# EAGLE board BLL-EBOOK-3506 (EAGLE 9.6.2)
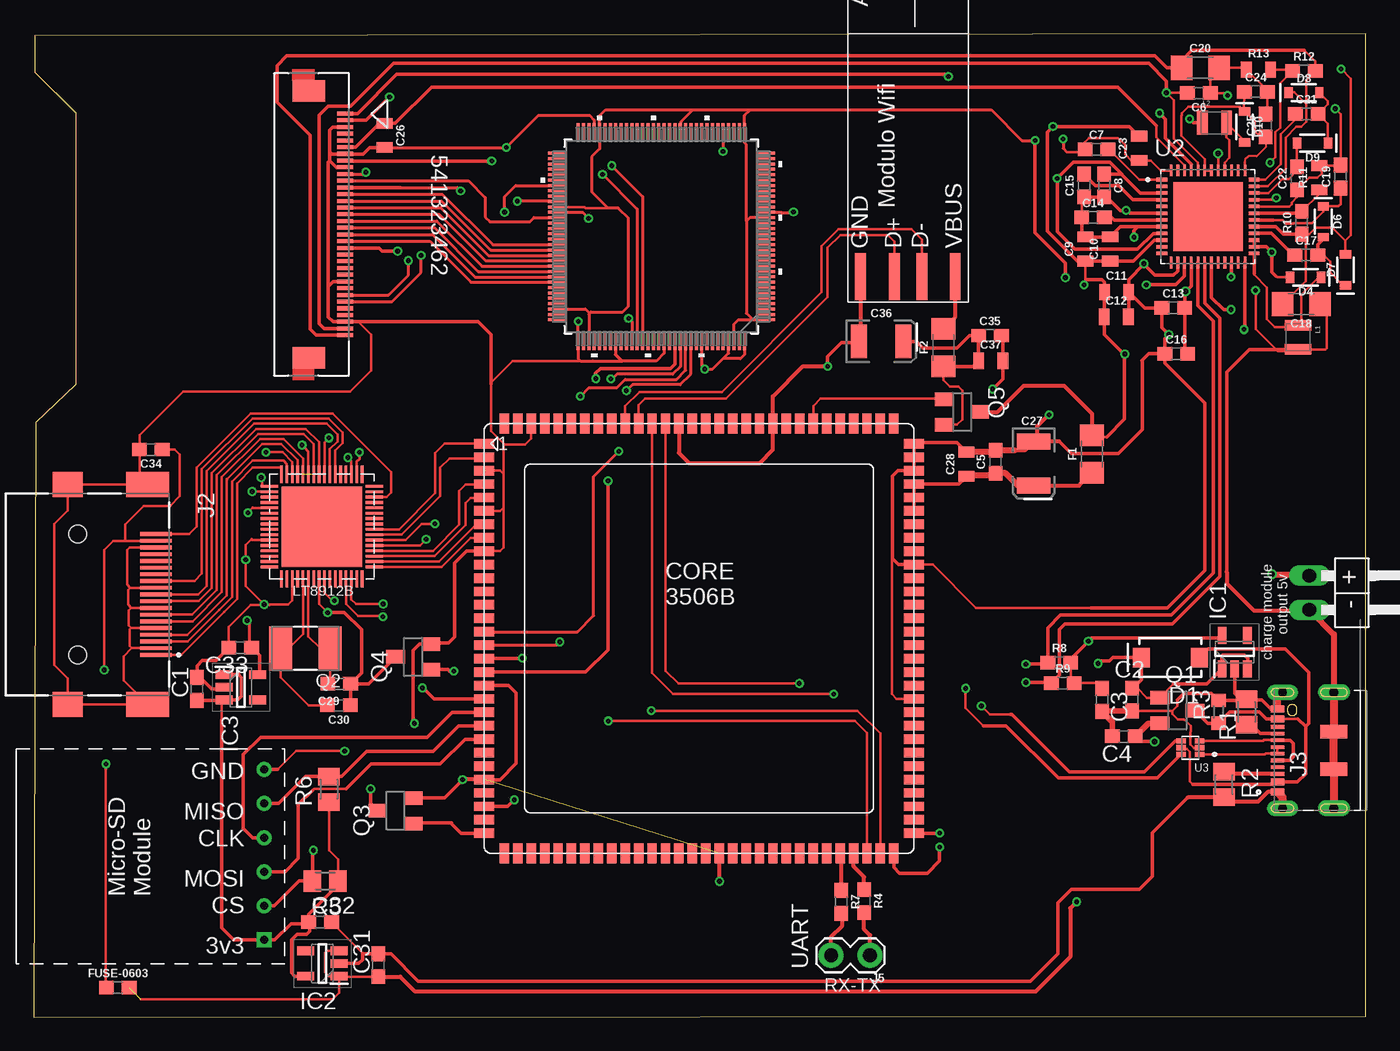
[diagram p2: board, top side]
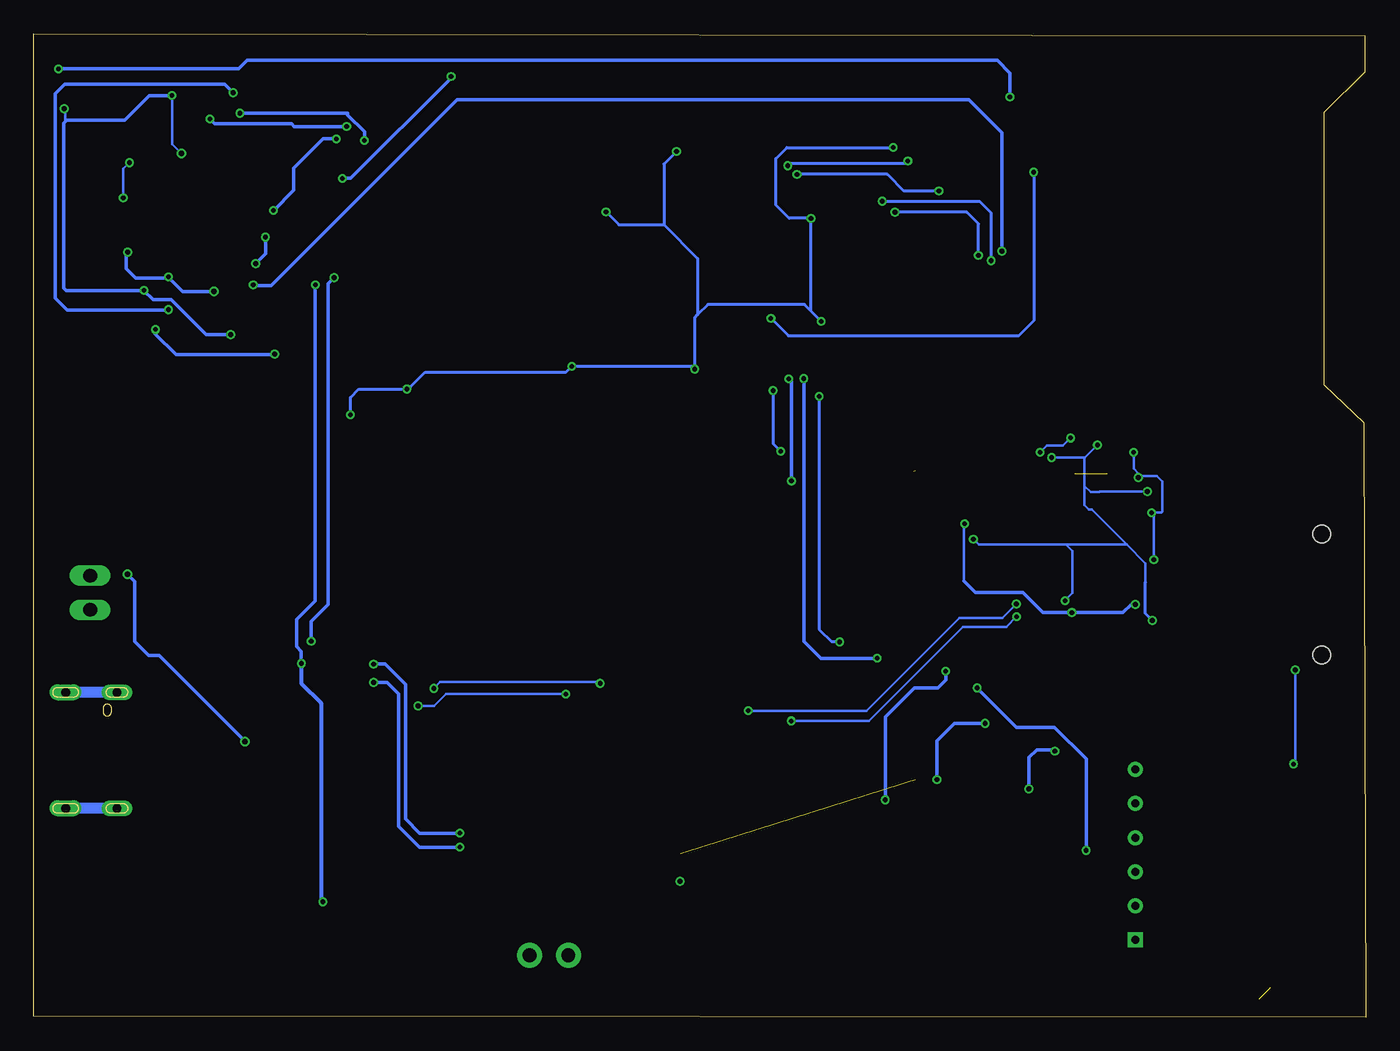
[diagram p3: board, bottom side, seen from below]

Size 99.21 x 73.24 mm. Coordinates in mm from the lower left corner, seen from the top.
Outline: 0,0 99.19,0.05 99.21,73.24 0.1,73.09 0.1,70.36 3.12,67.34 3.12,47.12 0.15,44.27 0,0
Copper layers (1*16): Top 0.035mm / dielectric 1.5mm / Bottom 0.035mm
Design rules "default *": minimum track width 6.5mil, minimum drill 0.15mm, track to track 6.5mil, track to pad 0.1mm, pad to pad 0.15mm, via to via 6mil, smd to smd 0.15mm, copper to edge 40mil, drill to drill 0.2mm, minimum pad ring 10mil, minimum via ring 0.15mm, stop-mask expansion 4mil, vias tented up to drill 0mil, thermal gap 10mil

## Footprints (pad centres in the part's own frame; a part is rotated, then mirrored left to right if it is on the bottom)
C0603 = smd 1.1 x 1: 1 -0.85,0; 2 0.85,0
0603 = smd 1.1 x 1: 1 -0.85,0; 2 0.85,0
0805 = smd 0.8 x 1.2: 1 -0.9,0; 2 0.9,0
1206 = smd 1.6 x 1.8: 1 -1.4,0; 2 1.4,0
EIA3528 = smd 1.2 x 2.5: A 1.65,0; C -1.65,0
SMA-DIODE = smd 1.27 x 1.47: A -2.15,0; C 2.15,0
SOD-323 = smd 0.63 x 0.83: A 1.15,0; C -1.15,0
SOT94P280X100-5N = smd 1.25 x 0.65: 1 -1.25,0.94; 2 -1.25,0; 3 -1.25,-0.94; 4 1.25,-0.94; 5 1.25,0.94
CON_541323462_MOL = smd 0.3 x 1.2: 1 -8.25,2.498; 2 -7.75,2.498; 3 -7.25,2.498; 4 -6.75,2.498; 5 -6.25,2.498; 6 -5.75,2.498; 7 -5.25,2.498; 8 -4.75,2.498; 9 -4.25,2.498; 10 -3.75,2.498; 11 -3.25,2.498; 12 -2.75,2.498; 13 -2.25,2.498; 14 -1.75,2.498; 15 -1.25,2.498; 16 -0.75,2.498; 17 -0.25,2.498; 18 0.25,2.498; 19 0.75,2.498; 20 1.25,2.498; 21 1.75,2.498; 22 2.25,2.498; 23 2.75,2.498; 24 3.25,2.498; 25 3.75,2.498; 26 4.25,2.498; 27 4.75,2.498; 28 5.25,2.498; 29 5.75,2.498; 30 6.25,2.498; 31 6.75,2.498; 32 7.25,2.498; 33 7.75,2.498; 34 8.25,2.498 | smd 1.6 x 2.4: P1 -9.95,-0.202; P2 9.95,-0.202
SAMTEC_HDMR-19-02-F-SM = smd 0.28 x 2.35: 01 4.5,5.825; 02 4,5.825; 03 3.5,5.825; 04 3,5.825; 05 2.5,5.825; 06 2,5.825; 07 1.5,5.825; 08 1,5.825; 09 0.5,5.825; 10 0,5.825; 11 -0.5,5.825; 12 -1,5.825; 13 -1.5,5.825; 14 -2,5.825; 15 -2.5,5.825; 16 -3,5.825; 17 -3.5,5.825; 18 -4,5.825; 19 -4.5,5.825 | smd 1.85 x 2.24: S1 -8.18,-0.76; S2 8.18,-0.76 | smd 1.85 x 3.2: S3 -8.18,5.2; S4 8.18,5.2 | hole 1.32: 4.5,0; -4.5,0
JAE_DX07S016JA1R1500 = smd 0.52 x 1: 1 -3.1,1.1; 2 -2.35,1.1; 11 2.35,1.1; 12 3.1,1.1 | smd 0.27 x 1: 3 -1.75,1.1; 4 -1.25,1.1; 5 -0.75,1.1; 6 -0.25,1.1; 7 0.25,1.1; 8 0.75,1.1; 9 1.25,1.1; 10 1.75,1.1 | smd 1 x 2: S1 -1.4,-3.1; S2 1.4,-3.1 | drill 0.65 long: S3 -4.32,0.725; S4 4.32,0.725 | drill 0.65 pad 1.2 long: S5 -4.32,-3.1; S6 4.32,-3.1
1X02/90 = drill 1.016 long: 1 -1.27,-3.81; 2 1.27,-3.81
1X02_LOCK = drill 1.016 pad 1.88: 1 -0.178,0; 2 2.718,0
1008(2520) = smd 0.8 x 2: 1 -0.9,0; 2 0.9,0
0806 = smd 0.8 x 1.8: 1 -0.9,0; 2 0.9,0
LT8912B = smd 5.969 x 5.969: 65 0,0 | smd 1.3 x 0.2: P0 -3.9,3; P1 -3.9,2.6; P2 -3.9,2.2; P3 -3.9,1.8; P4 -3.9,1.4; P5 -3.9,1; P6 -3.9,0.6; P7 -3.9,0.2; P8 -3.9,-0.2; P9 -3.9,-0.6; P10 -3.9,-1; P11 -3.9,-1.4; P12 -3.9,-1.8; P13 -3.9,-2.2; P14 -3.9,-2.6; P15 -3.9,-3; P16 3.9,-3; P17 3.9,-2.6; P18 3.9,-2.2; P19 3.9,-1.8; P20 3.9,-1.4; P21 3.9,-1; P22 3.9,-0.6; P23 3.9,-0.2; P24 3.9,0.2; P25 3.9,0.6; P26 3.9,1; P27 3.9,1.4; P28 3.9,1.8; P29 3.9,2.2; P30 3.9,2.6; P31 3.9,3 | smd 0.2 x 1.3: P32 -3,-3.9; P33 -2.6,-3.9; P34 -2.2,-3.9; P35 -1.8,-3.9; P36 -1.4,-3.9; P37 -1,-3.9; P38 -0.6,-3.9; P39 -0.2,-3.9; P40 0.2,-3.9; P41 0.6,-3.9; P42 1,-3.9; P43 1.4,-3.9; P44 1.8,-3.9; P45 2.2,-3.9; P46 2.6,-3.9; P47 3,-3.9; P48 3,3.9; P49 2.6,3.9; P50 2.2,3.9; P51 1.8,3.9; P52 1.4,3.9; P53 1,3.9; P54 0.6,3.9; P55 0.2,3.9; P56 -0.2,3.9; P57 -0.6,3.9; P58 -1,3.9; P59 -1.4,3.9; P60 -1.8,3.9; P61 -2.2,3.9; P62 -2.6,3.9; P63 -3,3.9
SOT23 = smd 1 x 1.4: 1 -0.95,-1.306; 2 0.95,-1.306; 3 0,1.306
5.0X3.2_2 = smd 1.7 x 3.3: 1 -1.85,0; 2 1.85,0
M0805 = smd 1.3 x 1.6: 1 -0.95,0; 2 0.95,0
R0603 = smd 1 x 1.1: 1 -0.85,0; 2 0.85,0
QFN50P700X700X100-49N = smd 0.86 x 0.26: 1 -3.435,2.75; 2 -3.435,2.25; 3 -3.435,1.75; 4 -3.435,1.25; 5 -3.435,0.75; 6 -3.435,0.25; 7 -3.435,-0.25; 8 -3.435,-0.75; 9 -3.435,-1.25; 10 -3.435,-1.75; 11 -3.435,-2.25; 12 -3.435,-2.75; 25 3.435,-2.75; 26 3.435,-2.25; 27 3.435,-1.75; 28 3.435,-1.25; 29 3.435,-0.75; 30 3.435,-0.25; 31 3.435,0.25; 32 3.435,0.75; 33 3.435,1.25; 34 3.435,1.75; 35 3.435,2.25; 36 3.435,2.75 | smd 0.26 x 0.86: 13 -2.75,-3.435; 14 -2.25,-3.435; 15 -1.75,-3.435; 16 -1.25,-3.435; 17 -0.75,-3.435; 18 -0.25,-3.435; 19 0.25,-3.435; 20 0.75,-3.435; 21 1.25,-3.435; 22 1.75,-3.435; 23 2.25,-3.435; 24 2.75,-3.435; 37 2.75,3.435; 38 2.25,3.435; 39 1.75,3.435; 40 1.25,3.435; 41 0.75,3.435; 42 0.25,3.435; 43 -0.25,3.435; 44 -0.75,3.435; 45 -1.25,3.435; 46 -1.75,3.435; 47 -2.25,3.435; 48 -2.75,3.435 | smd 5.15 x 5.15: 49 0,0
SOT50P160X60-6N = smd 0.75 x 0.35: 1 -0.69,0.5; 2 -0.69,0; 3 -0.69,-0.5; 4 0.69,-0.5; 5 0.69,0; 6 0.69,0.5
LQFP128_STM = smd 1.353 x 0.229: 1 -7.776,6.2; 2 -7.776,5.8; 3 -7.776,5.4; 4 -7.776,5; 5 -7.776,4.6; 6 -7.776,4.2; 7 -7.776,3.8; 8 -7.776,3.4; 9 -7.776,3; 10 -7.776,2.6; 11 -7.776,2.2; 12 -7.776,1.8; 13 -7.776,1.4; 14 -7.776,1; 15 -7.776,0.6; 16 -7.776,0.2; 17 -7.776,-0.2; 18 -7.776,-0.6; 19 -7.776,-1; 20 -7.776,-1.4; 21 -7.776,-1.8; 22 -7.776,-2.2; 23 -7.776,-2.6; 24 -7.776,-3; 25 -7.776,-3.4; 26 -7.776,-3.8; 27 -7.776,-4.2; 28 -7.776,-4.6; 29 -7.776,-5; 30 -7.776,-5.4; 31 -7.776,-5.8; 32 -7.776,-6.2; 65 7.776,-6.2; 66 7.776,-5.8; 67 7.776,-5.4; 68 7.776,-5; 69 7.776,-4.6; 70 7.776,-4.2; 71 7.776,-3.8; 72 7.776,-3.4; 73 7.776,-3; 74 7.776,-2.6; 75 7.776,-2.2; 76 7.776,-1.8; 77 7.776,-1.4; 78 7.776,-1; 79 7.776,-0.6; 80 7.776,-0.2; 81 7.776,0.2; 82 7.776,0.6; 83 7.776,1; 84 7.776,1.4; 85 7.776,1.8; 86 7.776,2.2; 87 7.776,2.6; 88 7.776,3; 89 7.776,3.4; 90 7.776,3.8; 91 7.776,4.2; 92 7.776,4.6; 93 7.776,5; 94 7.776,5.4; 95 7.776,5.8; 96 7.776,6.2 | smd 0.229 x 1.353: 33 -6.2,-7.776; 34 -5.8,-7.776; 35 -5.4,-7.776; 36 -5,-7.776; 37 -4.6,-7.776; 38 -4.2,-7.776; 39 -3.8,-7.776; 40 -3.4,-7.776; 41 -3,-7.776; 42 -2.6,-7.776; 43 -2.2,-7.776; 44 -1.8,-7.776; 45 -1.4,-7.776; 46 -1,-7.776; 47 -0.6,-7.776; 48 -0.2,-7.776; 49 0.2,-7.776; 50 0.6,-7.776; 51 1,-7.776; 52 1.4,-7.776; 53 1.8,-7.776; 54 2.2,-7.776; 55 2.6,-7.776; 56 3,-7.776; 57 3.4,-7.776; 58 3.8,-7.776; 59 4.2,-7.776; 60 4.6,-7.776; 61 5,-7.776; 62 5.4,-7.776; 63 5.8,-7.776; 64 6.2,-7.776; 97 6.2,7.776; 98 5.8,7.776; 99 5.4,7.776; 100 5,7.776; 101 4.6,7.776; 102 4.2,7.776; 103 3.8,7.776; 104 3.4,7.776; 105 3,7.776; 106 2.6,7.776; 107 2.2,7.776; 108 1.8,7.776; 109 1.4,7.776; 110 1,7.776; 111 0.6,7.776; 112 0.2,7.776; 113 -0.2,7.776; 114 -0.6,7.776; 115 -1,7.776; 116 -1.4,7.776; 117 -1.8,7.776; 118 -2.2,7.776; 119 -2.6,7.776; 120 -3,7.776; 121 -3.4,7.776; 122 -3.8,7.776; 123 -4.2,7.776; 124 -4.6,7.776; 125 -5,7.776; 126 -5.4,7.776; 127 -5.8,7.776; 128 -6.2,7.776
CORE3506 = smd 1.5 x 0.7: P$1 -16,14.5; P$2 -16,13.5; P$3 -16,12.5; P$4 -16,11.5; P$5 -16,10.5; P$6 -16,9.5; P$7 -16,8.5; P$8 -16,7.5; P$9 -16,6.5; P$10 -16,5.5; P$11 -16,4.5; P$12 -16,3.5; P$13 -16,2.5; P$14 -16,1.5; P$15 -16,0.5; P$16 -16,-0.5; P$17 -16,-1.5; P$18 -16,-2.5; P$19 -16,-3.5; P$20 -16,-4.5; P$21 -16,-5.5; P$22 -16,-6.5; P$23 -16,-7.5; P$24 -16,-8.5; P$25 -16,-9.5; P$26 -16,-10.5; P$27 -16,-11.5; P$28 -16,-12.5; P$29 -16,-13.5; P$30 -16,-14.5; P$61 16,-14.5; P$62 16,-13.5; P$63 16,-12.5; P$64 16,-11.5; P$65 16,-10.5; P$66 16,-9.5; P$67 16,-8.5; P$68 16,-7.5; P$69 16,-6.5; P$70 16,-5.5; P$71 16,-4.5; P$72 16,-3.5; P$73 16,-2.5; P$74 16,-1.5; P$75 16,-0.5; P$76 16,0.5; P$77 16,1.5; P$78 16,2.5; P$79 16,3.5; P$80 16,4.5; P$81 16,5.5; P$82 16,6.5; P$83 16,7.5; P$84 16,8.5; P$85 16,9.5; P$86 16,10.5; P$87 16,11.5; P$88 16,12.5; P$89 16,13.5; P$90 16,14.5 | smd 0.7 x 1.5: P$31 -14.5,-16; P$32 -13.5,-16; P$33 -12.5,-16; P$34 -11.5,-16; P$35 -10.5,-16; P$36 -9.5,-16; P$37 -8.5,-16; P$38 -7.5,-16; P$39 -6.5,-16; P$40 -5.5,-16; P$41 -4.5,-16; P$42 -3.5,-16; P$43 -2.5,-16; P$44 -1.5,-16; P$45 -0.5,-16; P$46 0.5,-16; P$47 1.5,-16; P$48 2.5,-16; P$49 3.5,-16; P$50 4.5,-16; P$51 5.5,-16; P$52 6.5,-16; P$53 7.5,-16; P$54 8.5,-16; P$55 9.5,-16; P$56 10.5,-16; P$57 11.5,-16; P$58 12.5,-16; P$59 13.5,-16; P$60 14.5,-16; P$91 14.5,16; P$92 13.5,16; P$93 12.5,16; P$94 11.5,16; P$95 10.5,16; P$96 9.5,16; P$97 8.5,16; P$98 7.5,16; P$99 6.5,16; P$100 5.5,16; P$101 4.5,16; P$102 3.5,16; P$103 2.5,16; P$104 1.5,16; P$105 0.5,16; P$106 -0.5,16; P$107 -1.5,16; P$108 -2.5,16; P$109 -3.5,16; P$110 -4.5,16; P$111 -5.5,16; P$112 -6.5,16; P$113 -7.5,16; P$114 -8.5,16; P$115 -9.5,16; P$116 -10.5,16; P$117 -11.5,16; P$118 -12.5,16; P$119 -13.5,16; P$120 -14.5,16
MICROSD-MOD = drill 0.6 square: P$1 -6.35,-6.35 | drill 0.6: P$2 -3.81,-6.35; P$3 -1.27,-6.35; P$4 1.27,-6.35; P$5 3.81,-6.35; P$6 6.35,-6.35
USB-A-SMT-MALE = smd 3.5 x 0.8: D+1 -8.1,1.027; D-1 -8.1,-1.027; GND1 -8.1,3.551; VBUS1 -8.1,-3.5

## Placement (x,y rotation side)
C1  10uF  [C0603]  12.17,24.43 90 top
C2  10uF  [C0603]  81.79,23.65 270 top
C3  10uF  [C0603]  79.55,23.62 270 top
C4  100uF  [C0603]  81.18,20.9 180 top
C5  1.0uF  [0603]  71.63,41.35 90 top
C6  4.7uF  [0603]  86.77,68.81 180 top
C7  4.7uF  [0603]  79.15,64.62 0 top
C8  4.7uF  [0603]  79.73,61.93 270 top
C9  10uF  [0805]  78.31,57.2 90 top
C10  22uF  [0805]  80.16,57.2 90 top
C11  10uF  [0805]  80.64,54 0 top
C12  22uF  [0805]  80.62,52.15 0 top
C13  4.7uF  [0603]  84.86,52.81 0 top
C14  4.7uF  [0603]  78.89,59.54 0 top
C15  4.7uF  [0603]  78.23,61.93 90 top
C16  4.7uF  [0603]  85.09,49.38 0 top
C17  10nF  [0603]  94.77,56.74 0 top
C18  2.2uF  [1206]  94.39,53.09 180 top
C19  100nF  [0603]  97.33,62.59 90 top
C20  2.2uF  [1206]  86.87,70.69 0 top
C21  10nF  [0603]  94.79,67.26 0 top
C22  100nF  [0603]  94.08,62.46 90 top
C23  10uF  [0805]  82.32,64.69 90 top
C24  4.7uF  [0603]  91.01,68.91 0 top
C25  4.7uF  [0603]  91.74,66.4 90 top
C26  10uF  [0805]  26.14,65.66 270 top
C27  100uF  [EIA3528]  74.47,41.22 270 top
C28  100nF  [0805]  69.47,41.17 90 top
C29  22pF  [0603]  22.76,24.82 180 top
C30  22pF  [0603]  22.73,23.22 180 top
C31  10uF  [C0603]  25.68,3.86 90 top
C32  10uF  [C0603]  21.34,7.06 0 top
C33  10uF  [C0603]  15.39,27.51 180 top
C34  1.0uF  [0603]  8.74,42.27 180 top
C35  1.0uF  [0603]  71.22,50.75 0 top
C36  100uF  [EIA3528]  63.12,50.32 0 top
C37  100nF  [0805]  71.27,48.87 0 top
D1  1A/40V/500mV  [SMA-DIODE]  84.65,26.77 180 top
D4  sod323  [SOD-323]  94.72,55.09 180 top
D6  sod323  [SOD-323]  96.04,59.23 270 top
D7  sod323  [SOD-323]  97.69,55.65 90 top
D8  sod323  [SOD-323]  94.59,68.83 0 top
D9  sod323  [SOD-323]  95.22,65.07 180 top
D10  sod323  [SOD-323]  90.17,66.29 270 top
F1  1206L150  [1206]  78.82,41.94 90 top
F2  1206L150  [1206]  67.74,49.86 90 top
FUSE-0603  500mA  [0603]  6.27,2.18 0 top
IC1  RT9080-33GJ5  [SOT94P280X100-5N]  89.43,27.18 90 top
IC2  RT9080-33GJ5  [SOT94P280X100-5N]  21.51,3.99 180 top
IC3  RT9080-18GJ5  [SOT94P280X100-5N]  15.44,24.56 0 top
J1  541323462  [CON_541323462_MOL]  20.7,59.03 270 top
J2  HDMR-19-02-F-SM  [SAMTEC_HDMR-19-02-F-SM]  3.3,31.47 270 top
J3  DX07S016JA1R1500  [JAE_DX07S016JA1R1500]  93.73,19.86 90 top
J4  BATT PAD  [1X02/90]  98.81,31.6 270 top
J5  [1X02_LOCK]  62.1,4.6 180 top
L1  4.7μH  [1008(2520)]  94.16,50.62 270 top
L2  2.2μH  [0806]  87.93,66.6 0 top
LT8912  LT8912B  [LT8912B]  21.46,36.53 180 top
Q1  IRLML6402TRPBF  [SOT23]  85.17,22.83 270 top
Q2  27Mhz Osc  [5.0X3.2_2]  20.24,27.46 180 top
Q3  AO3400  [SOT23]  26.95,15.37 90 top
Q4  AO3400  [SOT23]  28.27,26.82 90 top
Q5  AO3400  [SOT23]  69.14,45.06 270 top
R1  5.1k  [M0805]  90.32,22.72 90 top
R2  5.1k  [M0805]  88.65,17.32 270 top
R3  100k  [R0603]  88.24,22.73 90 top
R4  33  [0603]  61.85,8.64 270 top
R5  10k  [M0805]  21.72,10.13 180 top
R6  10k  [M0805]  22,16.97 90 top
R7  33  [0603]  60.15,8.59 270 top
R8  4.7k  [0603]  76.38,26.39 0 top
R9  4.7k  [0603]  76.63,24.87 0 top
R10  1M  [0603]  94.44,59.16 90 top
R11  53k  [0805]  95.73,62.51 90 top
R12  1M  [0603]  94.59,70.46 0 top
R13  47.5k  [0805]  91.21,70.56 0 top
U2  TPS65185RGZR  [QFN50P700X700X100-49N]  87.45,59.61 0 top
U3  USBLC6-2P6  [SOT50P160X60-6N]  86.14,20.06 180 top
U$1  IT8951  [LQFP128_STM]  46.75,58.13 180 top
U$3  LUCKFOX_CORE3506  [CORE3506]  49.56,28.19 0 top
U$4  MICROSD-MODULE  [MICROSD-MOD]  10.82,12.09 90 top
U$5  USB-WIFI-DONGLE  [USB-A-SMT-MALE]  65.13,63.25 90 top

## Tracks (layer width: path | path; a pad name or v marks a point on that pad's centre or on a via)
1.8V  (via drill 0.35)
  Top 0.203: LT8912.P4 28.77,35.12 v29.23,35.59 | LT8912.P34 23.66,41.41 v23.41,41.66 | LT8912.P17 16.3,39.12 v16.28,39.14 | LT8912.P42 20.46,42.11 20.17,42.4 20.17,42.43 v19.99,42.61 | LT8912.P56 21.66,31.6 22.25,31.01 v22.4,31.01
  Top 0.229: v15.9,29.54 16.05,29.39 16.05,27.7 C33.1
  Top 0.254: C33.1 16.82,26.93 16.82,25.63 IC3.5
  Bottom 0.203: 16.41,32.38 16.41,33.78 17.8,35.18 | 17.8,35.18 20.42,37.79 20.62,37.79 20.95,38.13 20.95,39.55 | v29.23,35.59 28.83,35.18 22.33,35.18 | 22.33,35.18 17.8,35.18 | v23.41,41.66 20.93,41.66 v19.99,42.61 20.95,41.64 20.95,39.55 | v16.28,39.14 19.81,39.14 19.86,39.09 20.5,39.09 20.95,39.55 | v22.4,31.01 21.84,31.57 21.84,34.7 22.33,35.18
  Bottom 0.229: 16.41,32.38 16.41,30.05 v15.9,29.54
3.3V  (via drill 0.35)
  Top 0.203: U2.45 86.2,63.53 | R9.2 79.16,24.87 C3.1 | 77.23,25.12 R8.2 77.23,26.68 | U$1.75 38.99,60.31 41.04,60.31 41.09,60.26 42.77,60.26 42.55,60.48
  Top 0.229: U$1.33 52.95,66.24 | 52.95,66.24 52.95,67.15 53.37,67.56 | U$1.20 53.33,59.53 53.09,59.28 | 53.09,59.28 53.09,52.43 53.58,51.93 | 53.58,51.93 U$1.1 | U$1.126 52.15,51.59 52.49,51.93 53.58,51.93 | U$1.94 41.1,52.73 41.35,52.48 41.35,52.35 | 41.35,52.35 U$1.99 | 42.77,60.26 43.52,60.26 44.3,59.48 44.3,52.93 43.87,52.5 41.5,52.5 41.35,52.35 | U$1.45 48.22,65.98 48.22,66.67 49.12,67.56 | 49.12,67.56 53.37,67.56 | 53.37,67.56 71.32,67.56 73.61,65.28 v74.57,65.28 | 52.95,66.24 52.93,66.23 52.93,65.13 53.09,64.97 53.09,59.28 | 49.12,67.56 42.6,67.56 42.15,67.12 U$1.60 42.15,64.65 41.55,64.06 41.55,61.47 42.55,60.48 42.69,60.33
  Top 0.254: v76.83,55.07 76.83,56.16 74.57,58.42 v74.57,65.28 | v83.84,67.31 84.28,66.88 84.28,65.46 86.2,63.53 | IC1.5 88.29,28.22 78.77,28.22 v78.54,27.99 77.23,26.68 | 77.23,25.12 R9.2
  Bottom 0.254: 78.51,27.97 v78.54,27.99 78.54,29.46 77.27,30.73 77.27,54.61 76.83,55.04 v76.83,55.07 | v74.57,65.28 74.57,65.94 75.82,67.18 75.82,67.31 v83.84,67.31
3.3V2
  Top 0.203: R6.1 22,12.42 22.67,11.75 22.67,9.96 | IC3.3 14.02,23.45 14.02,22.02
  Top 0.254: 20.38,6.96 19.18,6.96 17.96,5.74 U$4.P$1 14.91,5.74 14.02,6.63 14.02,22.02 14.02,22.13 | 20.38,6.96 C32.1 20.49,7.66 22.67,9.84 22.67,9.96 R5.1 | IC2.5 19.45,3.05 19.2,3.3 19.2,5.77 19.61,6.17 20.34,6.17 20.57,6.4 20.57,6.77 20.38,6.96 | C1.1 14.16,23.58 IC3.3 15.21,23.62 15.47,23.88 15.47,25.3 15.27,25.5 IC3.1
15V  (via drill 0.35)
  Top 0.203: C6.2 85.89,68.83 v84.35,68.83 84.92,68.27 84.92,65.43 86.7,63.65 U2.44
  Top 0.254: v89.18,52.68 88.62,52.68 87.7,53.6 U2.19 | J1.33 21.62,51.28 21.26,51.64 21.26,67.16 21.92,67.82 23.62,67.82 26.82,71.02 83.03,71.02 84.35,69.7 v84.35,68.83
  Bottom 0.254: v84.35,68.83 84.99,69.47 96.88,69.47 97.59,68.76 97.59,53.54 96.7,52.65 89.2,52.65 v89.18,52.68
+22V
  Top 0.203: 94.77,67.97 94.77,66.67 94.39,66.3 94.04,66.3 93.24,65.51 93.24,63.19 91.91,61.86 U2.35 | 94.62,71.99 95.44,71.17 R12.2 94.77,69.79 94.77,67.97 | D8.C 93.44,68.86 93.88,68.86 94.77,67.97
  Top 0.254: J1.34 21.05,50.78 20.6,51.23 20.6,65.66 18.14,68.12 18.14,70.87 18.85,71.58 83.49,71.58 84.38,70.69 C20.1 85.47,71.2 86.26,71.99 94.62,71.99
-15V  (via drill 0.35)
  Top 0.25: U2.9 83.37,58.36 82.19,57.18 77.55,57.18 76.22,58.5 v76.22,62.46
  Top 0.254: U2.3 82.43,61.36 81.01,62.77 | 81.01,62.77 81.04,62.77 80.14,63.68 77.44,63.68 v76.22,62.46 | 81.01,62.77 C8.1 | J1.1 24.11,67.28 27.03,70.2 68,70.2 68.15,70.05 v68.12,70.05
  Bottom 0.254: v68.12,70.05 68.12,69.93 75.59,62.46 v76.22,62.46
-20V  (via drill 0.35)
  Top 0.203: C18.2 93.01,53.09 94.74,54.81 94.74,58.01 R10.1 95.01,58.31 95.48,58.78 96.72,58.78 97.68,57.82 | D7.A 97.69,57.81 97.68,57.82 | v97.36,70.61 98.09,69.88 98.09,59.03 98.09,58.24 97.68,57.82
  Top 0.254: v26.52,68.53 24.77,66.78 J1.2 | R10.1 93.07,58.31 92.51,58.86 U2.29
  Bottom 0.254: v97.36,70.61 84.4,70.61 83.94,70.61 83.31,71.24 27.45,71.24 26.52,70.31 v26.52,68.53
CKV  (via drill 0.35)
  Top 0.229: J1.28 26.42,53.78 27.91,55.27 v27.91,56.34 | v36.02,60.76 38.95,60.76 U$1.74
  Bottom 0.229: v27.91,56.34 27.91,59.89 28.78,60.76 v36.02,60.76
D0
  Top 0.229: J1.13 30.44,61.28 34.21,57.51 38.64,57.51 38.65,57.52 U$1.82
D1
  Top 0.229: J1.14 30.38,60.78 34.04,57.12 38.8,57.12 38.81,57.12 U$1.83
D2
  Top 0.229: J1.15 30.32,60.28 33.88,56.72 U$1.84
D3
  Top 0.229: J1.16 30.21,59.78 33.66,56.33 U$1.85
D4
  Top 0.229: J1.17 30.03,59.28 33.38,55.92 U$1.86
D5
  Top 0.229: J1.18 29.87,58.78 33.12,55.53 U$1.87
D6
  Top 0.229: J1.19 29.71,58.28 32.86,55.12 U$1.88
D7
  Top 0.229: J1.20 29.52,57.78 32.57,54.73 U$1.89
DSI0-DN
  Top 0.203: LT8912.P1 30.19,33.92 32.96,36.69 U$3.P$7
DSI0-DP
  Top 0.203: U$3.P$8 32.53,35.69 30.36,33.52 LT8912.P0
DSI1-DN
  Top 0.203: U$3.P$4 33.53,39.67 32.18,39.67 31.67,39.17 31.67,36.66 29.73,34.72 LT8912.P3
DSI1-DP
  Top 0.203: U$3.P$5 33.53,38.67 32.55,38.67 32.16,38.28 32.16,36.63 29.86,34.32 LT8912.P2
DSI-CKN
  Top 0.203: U$3.P$1 30.6,42.69 29.91,42 29.91,39.03 27.21,36.32 LT8912.P7
DSI-CKP
  Top 0.203: U$3.P$2 33.47,41.6 30.96,41.6 30.28,40.92 30.28,38.81 27.39,35.92 LT8912.P6
EP-STV  (via drill 0.35)
  Top 0.229: J1.29 26.69,53.28 28.85,55.45 v28.85,56.72 | v35.08,59.94 35.08,61.11 35.89,61.93 U$1.71
  Bottom 0.229: v28.85,56.72 28.85,59.08 29.72,59.94 v35.08,59.94
EP-VCOM  (via drill 0.35)
  Top 0.254: J1.21 25.73,57.28 25.96,57.05 v27.1,57.05 | v82.85,54.53 85.04,54.53 85.7,55.2 U2.15
  Bottom 0.254: v27.1,57.05 27.1,65.86 29.57,68.33 67.69,68.33 81.53,54.48 82.8,54.48 v82.85,54.53
EPD-VDD
  Top 0.203: 83.62,66.4 83.62,65.53 85.7,63.45 U2.46
  Top 0.254: J1.6 23.98,64.78 25.76,66.56 C26.1 26.92,66.56 29.63,69.27 80.75,69.27 83.62,66.4
GND  (via drill 0.35, 0.4)  (2 unrouted)
  Top 0.203: v90.99,54.11 90.99,51.24 92.63,49.61 94.04,49.61 L1.2 96.18,49.72 96.29,49.83 96.29,52.58 C18.1 | R11.2 95.91,63.41 | 95.91,63.41 97.28,63.41 97.33,63.46 | U2.32 93.52,60.36 93.68,60.52 93.68,60.66 94.08,61.06 C22.1 94.98,62.51 95.61,62.51 95.91,62.81 95.91,63.41 | R13.1 90.56,71.08 | v96.93,67.65 97.33,67.25 C19.2 | 91.46,67.25 C25.2 | 76.68,64.69 76.96,64.41 78.09,64.41 C7.1 78.3,65.16 78.59,65.46 80.75,65.46 81.28,64.92 81.28,64.26 81.75,63.79 C23.1 83.2,63.79 83.95,63.04 U2.48 | 91.74,66.94 C25.2 | C2.2 84.8,22.8 | 85.17,23.62 85.17,23.16 84.8,22.8 | U3.2 86.39,20.06 86.13,20.32 86.13,21.21 86.18,21.26 86.18,21.69 85.74,22.13 85.69,22.13 85.65,22.17 85.19,22.17 84.8,22.57 84.8,22.8 | C14.1 78.04,60.89 C15.1 | C20.2 88.37,70.69 | 88.37,70.69 90.18,70.69 R13.1 | v88.9,68.63 88.72,68.81 C6.1 87.62,69.94 88.37,70.69 | R13.1 91.86,69.01 C24.2 91.86,67.36 C25.2 | U2.41 88.2,64.3 v88.19,64.31 | 35,40.44 34.74,40.69 33.68,40.69 33.65,40.67 | 35,37.95 35,40.44 | U$3.P$6 34.75,37.69 35,37.95 | 35,37.95 35,34.98 34.72,34.69 U$3.P$9 | 35,40.44 35,42.65 | 35,42.65 35,42.7 34.06,43.64 34.06,47.14 34.06,47.27 35.66,48.87 41.66,48.87 | U$3.P$81 66.96,33.69 70.18,30.47 80.01,30.47 | C32.2 24.49,4.76 | 24.13,51.78 24.17,51.78 25.12,50.83 25.12,48.13 23.57,46.58 11.14,46.58 7.89,43.33 C34.2 7.89,40.26 J2.S3 J2.S1 2.54,37.72 1.52,36.71 1.52,26.23 2.54,25.22 J2.S2 J2.S4 6.71,25.09 6.71,26.87 7.31,27.48 | 7.31,27.48 J2.02 | J2.05 7.28,28.97 | 7.28,28.97 7.16,28.85 7.16,27.63 7.31,27.48 | J2.08 7.28,30.47 | 7.28,30.47 7.09,30.28 7.09,29.16 7.28,28.97 | J2.11 7.21,31.97 | 7.21,31.97 7.04,31.8 7.04,30.71 7.28,30.47
  Top 0.203: J2.17 7.16,34.97 6.96,34.77 6.96,32.22 7.21,31.97 | 35,42.65 36.6,42.65 37.05,43.1 U$3.P$118 | U$3.P$71 64.27,23.69 63.91,24.05 63.91,34.09 63.96,34.14
  Top 0.229: v76.66,65.4 76.68,65.38 76.68,64.69 | C26.2 v35.19,64.76 37.59,67.16 41.4,67.16 41.75,66.81 U$1.61 | U$1.125 51.75,49.44 51.33,49.02 | U$1.120 49.75,48.5 v49.99,48.26 50.57,48.26 51.33,49.02 | U$1.128 52.95,49.34 52.63,49.02 51.33,49.02 | U$1.21 55.69,59.93 55.7,59.92 56.54,59.92 v56.59,59.97 | U$1.37 51.35,64.48 v51.33,64.46 | U$1.76 40.88,59.93 v41.33,59.49 | v40.56,51.82 40.55,51.8 U$1.97 40.55,49.04 40.72,48.87 41.66,48.87 43.82,48.87 46.38,48.87 46.95,49.44 U$1.113 | U$1.104 43.35,49.33
  Top 0.25: J3.1 92.24,16.76 | C16.1 84.24,48.7 87.22,45.72 87.22,44.65
  Top 0.254: J3.12 92.12,22.96 91.46,23.62 90.37,23.62 | 90.37,23.62 R1.2 | 90.37,23.62 90.33,23.58 89.97,23.58 | 89.97,23.58 R3.2 87.72,24.1 85.65,24.1 85.17,23.62 | 21.95,54.41 21.95,52.15 22.31,51.78 J1.32 24.13,51.78 33.11,51.78 34.06,50.83 34.06,47.14 | J1.26 22.32,54.78 21.95,54.41 | J1.3 22.26,66.28 22.05,66.07 22.05,64.46 | 22.05,64.46 22.23,64.28 J1.7 24.53,64.28 25.01,64.76 C26.2 | J1.9 22.56,63.27 22.05,63.79 | 22.05,63.79 22.05,64.46 | 21.95,54.41 21.95,63.68 22.05,63.79 | 82.24,58.86 80.92,58.86 C10.2 C9.2 78.04,58.37 C14.1 | 82.24,58.86 U2.8 | U2.6 81.63,59.86 81.4,60.09 81.38,60.09 v81.36,60.07 80.94,60.07 79.93,61.07 C8.2 C15.1 | C11.2 82.74,52.81 C13.1 84.01,51.34 v84.53,50.83 84.24,50.53 C16.1 84.21,49.4 83.03,49.4 82.52,48.89 82.55,48.87 82.55,43.74 80.77,41.96 77.29,41.96 76.38,42.87 | C12.2 81.55,52.17 C11.2 | v90.99,54.11 90.99,53.82 | 97.33,63.46 C19.2 | U2.14 85.2,55.56 84.89,55.24 83.49,55.24 82.68,56.06 | 82.68,56.06 v82.68,56.11 | v81.94,58.09 81.94,58.56 82.24,58.86 | C11.2 81.55,54.93 82.68,56.06 | L1.2 90.53,49.72 88.85,48.05 88.85,33.15 | IC1.2 89.43,24.12 89.97,23.58 | 78.74,30.47 80.01,30.47 84.42,30.47 87.22,33.27 87.22,44.65 | 65.55,42.62 U$3.P$89 U$3.P$88 64.37,40.69 63.96,40.28 63.96,34.14 64.4,33.69 U$3.P$81 | 65.55,42.62 U$3.P$90 | C28.2 68.77,42.77 65.71,42.77 65.55,42.62 | R2.2 88.33,16.05 | 43.35,49.33 43.82,48.87 | IC2.2 24.21,3.99 24.49,4.27 24.49,4.76 24.54,4.71 C31.2 26.62,4.71 28.65,2.68 74.23,2.68 76.28,4.72 76.28,8.51 77.29,9.52 82.35,9.52 83.31,10.49 83.31,13.72 85.94,16.35 | Q3.2 30.59,16.32 31.97,17.69 | U$3.P$3 33.53,40.72 | v28.35,21.87 28.27,21.95 28.27,27.3 28.74,27.77 Q4.2 29.67,27.86 30.91,27.86 31.37,28.32 31.37,33.83 32.23,34.69 U$3.P$9
  Top 0.254: C35.2 72.17,50.65 C37.2 72.17,47.51 v71.42,46.76 | C36.C 61.39,50.24 60.17,50.24 59.13,49.2 v59.13,48.46 | U$3.P$19 35.34,24.69 35.36,24.71 35.93,24.14 35.93,18.88 34.72,17.68 33.57,17.68 U$3.P$26
  Top 0.305: 96.83,15.34 J3.S5 | 92.24,16.76 91.9,16.76 91.19,16.05 88.97,16.05 R2.2 88.62,16.35 85.94,16.35 | 96.83,24.33 J3.S6 | U$3.P$26 31.97,17.69 v31.95,17.68 | U$3.P$47 51.05,10.13 v51.08,10.11 | 88.85,33.15 88.85,32.28 90.87,30.26 95.06,30.26 | U$5.GND1 61.58,50.42 C36.C | C27.C 73.8,42.2 73.04,42.2 | C27.C 74.73,43.13 74.73,43.97 v75.62,44.86 | 76.38,42.87 C27.C | U$3.P$107 48.05,42.01 48.79,41.27 54.08,41.27 55.05,42.25 U$3.P$100 55.05,46.22 57.3,48.46 v59.13,48.46
  Top 0.406: C2.2 79.58,22.8 C3.2 80.33,22 C4.2
  Top 0.457: C28.2 71.5,42.07 C5.2 73.04,42.2 | 96.62,24.39 J3.S6 96.83,28.5 95.06,30.26 J4.2
  Top 0.61: J3.1 93,16.39 J3.S3 | J3.12 92.63,23.81 J3.S4 | J3.S6 J3.S2 J3.S1 J3.S5
  Bottom 0.203: 96.86,66.69 96.86,67.58 v96.93,67.65 | v88.19,64.31 88.9,65.02 v88.9,68.63
  Bottom 0.229: v75.62,44.86 75.62,46.15 75.01,46.76 v71.42,46.76 71.27,46.91 71.17,46.91 70.05,48.03 59.56,48.03 v59.13,48.46 50.19,48.46 v49.99,48.26 49.99,52.07 49.76,52.3 | v56.59,59.97 55.63,59 52.27,59 | 52.27,59 49.76,56.49 49.76,52.3 | v51.33,64.46 52.27,63.53 52.27,59 | v35.19,64.76 43.12,64.76 43.94,63.93 43.94,60.48 42.95,59.49 v41.33,59.49 41.33,52.58 | v40.56,51.82 41.33,52.58 | 41.33,52.58 41.81,53.06 49,53.06 49.76,52.3
  Bottom 0.254: v88.9,68.63 90.6,68.63 92.43,66.8 96.75,66.8 96.86,66.69 96.98,66.57 96.98,54.3 96.79,54.11 v90.99,54.11 90.3,53.42 88.95,53.42 86.36,50.83 v84.53,50.83 | v76.66,65.4 77.65,65.4 78.61,64.44 79.83,63.22 79.83,61.57 81.33,60.07 v81.36,60.07 | v82.68,56.11 81.94,56.84 v81.94,58.09 | v28.35,21.87 30.66,21.87 31.95,20.57 v31.95,17.68
  Bottom 0.813: J3.S4 J3.S6 | J3.S3 J3.S5
GPIO-HDMI  (via drill 0.35)
  Top 0.254: Q4.1 30.87,25.87 30.99,25.76 v31.29,25.76 | U$3.P$28 35.3,15.69 v35.79,16.18
  Bottom 0.254: v35.79,16.18 35.79,22.35 33.63,24.51 31.88,24.51 31.29,25.09 v31.29,25.76
GPIO-SD
  Top 0.254: Q3.1 28.29,14.45 31.14,14.45 31.14,14.38 31.82,13.69 U$3.P$30
GPIO-USB
  Top 0.203: U$3.P$97 58.05,45.51 58.6,46.05 67.79,46.05 Q5.1
H-CS  (via drill 0.35)
  Top 0.254: U$1.115 47.75,48.61 47.45,48.31 42.22,48.31 41.86,47.95 v41.86,47.55 | v36.4,26.72 33.58,26.72 U$3.P$17
  Bottom 0.254: v41.86,47.55 41.86,27.99 40.59,26.72 v36.4,26.72
H-MISO  (via drill 0.35)
  Top 0.229: U$1.118 48.95,47.89 48.15,47.09 44.6,47.09 44.17,46.66 v44.15,46.66 | U$3.P$15 40.51,28.69 41.71,29.9 41.71,40.26 v43.59,42.14
  Bottom 0.229: v44.15,46.66 44.15,42.7 v43.59,42.14
H-MOSI  (via drill 0.35)
  Top 0.229: U$1.117 48.56,48.18 47.87,47.48 44.06,47.48 43.43,46.86 41.35,46.86 v40.72,46.23 | v39.19,27.94 38.95,27.69 U$3.P$16
  Bottom 0.229: v40.72,46.23 40.72,28.88 39.78,27.94 v39.19,27.94
H-SCK  (via drill 0.35)
  Top 0.229: U$1.116 48.16,50.19 48.16,50.18 48.16,48.45 47.59,47.88 43.43,47.88 43.08,47.52 v42.98,47.52
  Top 0.254: U$3.P$18 41.11,25.69 42.77,27.36 v42.77,39.93
  Bottom 0.254: v42.77,39.93 42.77,47.32 v42.98,47.52
HDMI-CKN
  Top 0.203: J2.12 11.99,32.47 12.54,33.02 12.54,40.82 16.31,44.59 21.97,44.59 23.01,43.55 23.01,42.73 22.46,42.19 22.46,41.93 LT8912.P37
HDMI-CKP
  Top 0.203: J2.10 12.27,31.47 12.9,32.11 12.9,40.66 16.44,44.2 21.82,44.2 22.62,43.39 22.62,42.87 22.06,42.31 22.06,42.05 22.06,40.87 LT8912.P38
HDMITX0-DN
  Top 0.203: LT8912.P40 21.26,42.81 20.26,43.81 16.57,43.81 13.27,40.51 13.27,31.95 12.29,30.97 J2.09
HDMITX0-DP
  Top 0.203: LT8912.P41 20.87,42.66 20.1,43.43 16.71,43.43 13.64,40.36 13.64,31.8 11.81,29.97 J2.07
HDMITX1-DN
  Top 0.203: J2.06 11.83,29.47 14.01,31.65 14.01,40.21 16.86,43.06 18.62,43.06 20.08,41.6 20.08,40.44 LT8912.P43
HDMITX1-DP
  Top 0.203: J2.04 11.44,28.47 14.38,31.41 14.38,40 | 14.38,40 14.38,40.05 | 14.38,40 14.4,40.03 14.4,40.06 17.04,42.69 18.43,42.69 19.66,41.47 LT8912.P44
HDMITX2-DN
  Top 0.203: J2.03 11.47,27.97 13.81,30.3 13.81,30.32 14.77,31.28 14.77,39.9 16.31,41.44 18.62,41.44 18.86,41.2 LT8912.P46
HDMITX2-DP
  Top 0.203: J2.01 10.99,26.97 14.17,30.15 14.17,30.16 15.16,31.15 15.16,39.75 16.33,40.92 18.46,40.92 LT8912.P47
HPD
  Top 0.203: J2.19 11.59,35.97 12.14,36.52 12.14,40.94 16.16,44.96 22.26,44.96 26.62,40.59 26.62,39.06 26.28,38.72 LT8912.P13
I2C1-SCL  (via drill 0.35)
  Top 0.254: U2.17 86.7,52.98 87.86,51.82 87.86,33.07 84.72,29.93 76.47,29.93 75.53,28.99 R8.1 75.43,26.29 v73.89,26.29 | U$3.P$61 v67.46,13.69
  Bottom 0.254: v73.89,26.29 73.02,26.29 71.53,24.79 71.53,14.76 70.46,13.69 v67.46,13.69
I2C1-SDA  (via drill 0.35)
  Top 0.254: U2.18 87.2,53.18 88.34,52.04 88.34,32.82 84.78,29.26 76.81,29.26 76.4,28.85 76.4,27.01 76.4,25.48 R9.1 75.73,24.92 v73.89,24.92 | v67.46,12.65 67.46,11.63 66.55,10.72 64.49,10.72 64.05,11.15 U$3.P$60
  Bottom 0.254: v73.89,24.92 72.9,24.92 72.03,24.05 72.03,14.2 70.48,12.65 v67.46,12.65
I2C-SCL  (via drill 0.35)
  Top 0.203: LT8912.P61 23.66,31.1 24,30.76 v26.04,30.76 | v46,22.81 61.37,22.81 63.05,21.12 U$3.P$59
  Bottom 0.203: v26.04,30.76 27.08,29.72 30.28,29.72 37.19,22.81 v46,22.81
I2C-SDA  (via drill 0.35)
  Top 0.203: LT8912.P60 23.27,30.78 24.18,29.87 25.96,29.87 v26.01,29.82 | U$3.P$58 62.05,21.15 61.16,22.05 v42.8,22.05
  Bottom 0.203: v42.8,22.05 37.01,22.05 30,29.06 26.77,29.06 v26.01,29.82
I/O1_1
  Top 0.203: J3.7 J3.6 92.6,19.63 91.77,19.63 91.7,19.56 U3.1
I/O2_1
  Top 0.203: U3.3 91.56,20.56 91.62,20.62 92.61,20.62 J3.8
  Top 0.254: J3.8 93.59,20.61 93.8,20.4 93.8,19.38 93.53,19.11 J3.5
N$1
  Top 0.203: LT8912.P53 20.46,28.36 21.36,27.46 Q2.1 22.09,25 C29.2
  Top 0.254: C29.2 22.07,24.82
N$2
  Top 0.203: LT8912.P52 20.06,28.54 18.98,27.46 Q2.2 18.39,25.29 20.47,23.22 C30.2
N$3
  Top 0.305: J3.3 88.81,18.11 R2.1
N$4
  Top 0.254: R1.1 90.7,21.77 91.36,21.11 J3.9
N$5
  Top 0.305: F2.2 68.63,52.14 U$5.VBUS1
N$6
  Top 0.305: J5.1 62.28,6.1 61.85,6.53 R4.2
N$9
  Top 0.305: J5.2 59.39,5.97 60.22,6.81 60.22,7.66 R7.2
N$12
  Top 0.203: C7.2 80.09,64.62 82.35,62.36 U2.1
N$13
  Top 0.25: U2.4 81.86,60.86 80.8,61.92 79.07,61.92 C15.2
N$14
  Top 0.254: U2.7 80.46,59.36 80.29,59.54 C14.2
N$15
  Top 0.203: 90.89,55.38 90.89,55.29 91.85,54.33 91.85,51.97 92.43,51.38 94.02,51.38 L1.1 94.41,51.52 94.41,53.82 95.69,55.09 D4.C
  Top 0.254: U2.25 90.89,55.38
N$16
  Top 0.254: U2.28 90.9,58.37 92.18,58.37 93.81,56.74 C17.1
N$17
  Top 0.203: C17.2 96.07,56.74 96.55,56.27 96.55,55.47 97.31,54.71 97.48,54.71 D7.C
  Top 0.254: D6.A 96.04,57.95 95.62,57.53 C17.2
N$19
  Top 0.203: U2.36 91.73,62.36 92.86,63.5 92.86,65.73 93.94,66.82 C21.1
N$35  (via drill 0.35)
  Top 0.203: J2.18 6.81,35.47 | 6.81,35.47 5.93,35.47 5.26,34.8 v5.26,25.86 | v5.38,18.85 5.38,2.22 FUSE-0603.1 | 6.81,35.47 6.81,36.68 8.2,38.07 10.16,38.07 10.87,38.79 10.87,41.91 10.52,42.27 C34.1
  Bottom 0.203: v5.26,25.86 5.26,18.97 v5.38,18.85
P
  Top 0.254: C28.1 68.89,39.69 U$3.P$87 U$3.P$86 U$3.P$85
  Top 0.305: C27.A 77.85,39.57 F1.1
  Top 0.457: 69.23,40.03 C28.1 69.52,40.32 71.45,40.32 C5.1 72.38,40.5 73.3,39.57 C27.A
P1
  Top 0.203: 67.74,48.29 F2.1 67.74,47.45 68.22,46.96 68.86,46.96 69.16,46.66 69.16,44.5 68.77,44.11 Q5.2
  Top 0.254: C36.A 65.73,50.32 66.22,49.83 68.76,49.83 69.67,50.75 C35.1 C37.1 69.96,48.46 F2.1
P30
  Top 0.203: 92.33,59.36 93.01,59.36 93.29,59.08 93.8,59.08 93.83,59.11 95.18,59.11 96.04,59.97 D6.C 97.16,60.38 97.33,60.55 C19.1
  Top 0.254: U2.30 92.33,59.36
P31
  Top 0.203: R10.2 95.73,61.3 R11.1
  Top 0.254: U2.31 94.29,59.86 R10.2
P33  (via drill 0.35)
  Top 0.203: U2.33 92.4,60.86 v92.53,61 | v92.07,63.63 92.48,64.03 92.48,65.89 92.84,66.24 92.84,69.56 R12.1 93.64,70.56 R13.2
  Bottom 0.203: v92.53,61 92.53,63.17 v92.07,63.63
P34
  Top 0.203: U2.34 91.94,61.36 92.97,62.39 93.45,62.39 94.08,63.02 C22.2 D9.A
P36
  Top 0.203: D9.C 96.38,66.53 C21.2 96.37,67.98 96.37,68.21 D8.A
P37
  Top 0.165: C25.1 91.74,64.77 91.08,64.11 90.47,64.11 90.2,63.84 90.2,63.66
  Top 0.203: U2.42 U2.43 87.2,63.88 85.45,65.62 85.45,67.14 85.5,67.18 85.5,67.31 85.98,67.79 89.82,67.79 90.1,67.51 | 90.17,63.08 U2.37 90.2,63.66 | C24.1 90.1,67.51 | 90.1,67.51 D10.C | D10.C 90.3,67.44 | 91.74,65.2 C25.1 91.38,65.55 90.93,65.99 90.93,66.68 D10.C
P40
  Top 0.203: U2.40 88.7,63.63 89.05,63.98 89.05,65.3 88.83,65.52 L2.2 90.17,65.26 D10.A
SPI-CLK
  Top 0.254: U$3.P$21 31.17,22.69 29.31,20.84 16.9,20.84 15.62,19.56 15.62,14.07 16.33,13.36 U$4.P$4
SPI-CS  (via drill 0.35)
  Top 0.254: U$3.P$20 29.82,23.69 29.01,24.51 v28.96,24.51 | U$4.P$2 17.92,8.28 19.78,10.13 R5.2 20.77,12.36 v20.83,12.42
  Bottom 0.254: v20.83,12.42 20.83,19.23 23.19,21.59 26.04,21.59 v28.96,24.51
SPI-MISO
  Top 0.254: U$4.P$5 18.24,15.9 20.25,17.92 R6.2 22.95,17.92 24.82,19.79 29.74,19.79 31.65,21.69 U$3.P$22
SPI-MOSI
  Top 0.203: 20.78,16.89 20.88,16.99 23.29,16.99
  Top 0.254: U$4.P$3 18.72,10.82 19.71,11.81 19.71,15.82 20.78,16.89 | 23.29,16.99 25.14,18.84 30.28,18.84 32.13,20.69 U$3.P$23
SW1  (via drill 0.35)
  Top 0.203: v23.16,19.81 19.56,19.81 18.19,18.44
  Top 0.254: U$4.P$6 18.19,18.44 | v25.09,16.99 25.09,15.91 Q3.3
  Bottom 0.254: v23.16,19.81 23.27,19.91 24.51,19.91 25.09,19.33 v25.09,16.99
SW2  (via drill 0.35)  (1 unrouted)
  Top 0.203: 16.92,37.92 LT8912.P20 16.36,37.92 16.33,37.95 v15.95,37.57 | LT8912.P50 19.26,31.02 18.97,30.73 17.6,30.73 | 17.6,30.73 v17.17,30.73 15.79,32.11 v15.79,34.05 15.79,35.14 16.23,35.59 16.29,35.52 LT8912.P26 | v21.89,30.12 21.26,30.76 LT8912.P55 | LT8912.P5 27.7,35.52 28.9,36.73 v29.87,36.73 | C33.2 14.54,29.07 16.18,30.71 17.58,30.71 17.6,30.73 | LT8912.P45 19.26,41.34 18.54,42.07 v17.3,42.07 | LT8912.P16 17.01,39.52 17.01,40.12 v16.94,40.18 | v22,43.13 21.66,42.8 LT8912.P39 | v24.26,42.06 24.26,41.56 24.06,41.35 LT8912.P33
  Top 0.254: C29.1 24.96,24.82 Q4.3 | C30.1 23.61,23.24 C29.1 | v21.89,30.12 23.14,30.12 24.41,28.85 24.41,25.62 C29.1 | IC3.2 14.07,24.43 13.26,24.43 12.41,25.28 C1.2 12.17,26.16 12.57,26.57 13.6,26.57 C33.2 14.19,27.86 | v17.17,30.73 17.14,30.76
  Bottom 0.203: 29.95,32.49 29.95,36.65 v29.87,36.73 | v17.3,42.07 17.3,40.84 16.94,40.49 v16.94,40.18 16.84,40.28 15.57,40.28 15.16,39.88 15.16,37.64 15.24,37.57 v15.95,37.57 15.79,37.41 v15.79,34.05 | v22,43.13 22.55,42.57 23.76,42.57 v24.26,42.06
  Bottom 0.254: v17.17,30.73 17.47,30.73 18.08,30.12 v21.89,30.12 24.05,30.12 25.55,31.62 29.08,31.62 29.95,32.49
UART0-RX
  Top 0.254: 60.05,9.53 R7.1
  Top 0.305: R7.1 60.15,12.1 U$3.P$56
UART0-TX
  Top 0.305: 61.09,12.16 U$3.P$57 61.05,11.23 61.85,10.44 R4.1
USB1+
  Top 0.203: U$3.P$110 45.05,45.59 45.54,46.08 51.58,46.08 59.12,53.62 59.12,57.29 60.07,58.24 63.6,58.24 64.1,57.74 U$5.D+1
USB1-
  Top 0.203: U$5.D-1 66.15,57.9 65.38,58.67 59.92,58.67 58.67,57.43 58.67,53.97 51.26,46.56 45.11,46.56 44.05,45.5 U$3.P$111
USB+  (via drill 0.35)
  Top 0.203: 70.74,21.69 69.41,23.02 v69.41,24.47 | v57.02,24.84 48.01,24.84 47.05,25.79 U$3.P$108
  Top 0.254: U3.6 83.69,17.81 76.3,17.81 72.41,21.69 70.74,21.69
  Bottom 0.203: v69.41,24.47 68.94,24.94 57.12,24.94 v57.02,24.84
USB-  (via drill 0.35)
  Top 0.203: U$3.P$109 46.05,25.62 47.62,24.05 v59.59,24.05 | v70.57,23.18 71.22,22.53 72.73,22.53
  Top 0.254: U3.4 85.03,20.56 82.73,18.26 77.11,18.26 72.85,22.53 72.73,22.53
  Bottom 0.203: v59.59,24.05 68.5,24.05 69.38,23.18 v70.57,23.18
VBAT  (via drill 0.4)
  Top 0.254: C4.1 82.41,20.52 v83.46,20.52
  Top 0.406: C4.1 83.01,21.88 Q1.2
  Top 0.457: v92.23,32.97 94.89,32.97 J4.1
  Bottom 0.254: v83.46,20.52 89.86,26.92 90.63,26.92 91.69,27.99 91.69,32.44 v92.23,32.97
VBUS
  Top 0.203: J3.2 92.45,17.33 92.39,17.33 92.38,17.32 | U3.5 85.55,19.96 85.88,19.96 86.11,19.73 86.11,17.55 86.33,17.32 | J3.11 94.14,22.21
  Top 0.25: J3.2 92.73,17.51
  Top 0.254: 94.06,26.57 94.95,25.67 94.95,21.88 94.72,21.64 | 94.06,26.57 93.8,26.82 | 94.14,22.21 94.72,21.64 | 94.72,21.64 94.72,18.11 94.12,17.51 92.73,17.51 J3.2 | J3.11 91.78,22.21 91.29,22.71 89.06,22.71 R3.1 87.42,21.88 Q1.3 | 92.38,17.32 86.33,17.32 | D1.A 87.46,27.43 93.19,27.43 94.06,26.57
VIN  (via drill 0.35)  (1 unrouted)
  Top 0.165: 21.72,3.33 21.72,4.8
  Top 0.203: 84.89,24.81 Q1.1 82.89,23.78 82.18,24.5 C2.1 | 78.46,54.91 78.23,54.69 v78.23,54.53 78.31,54.61 C9.1 | 25.83,3.16 C31.1 22.8,3.01 IC2.1 | IC2.3 21.84,4.93 21.72,4.8 | IC2.1 22,3.05 21.72,3.33 | 7.99,1.32 22.28,1.32 22.76,1.81 IC2.1 | 79.91,43.21 78.95,43.21 F1.2
  Top 0.254: 78.23,56.22 C9.1 | C9.1 C10.1 81.9,56.3 83.47,57.86 U2.10 | 78.46,54.91 79.55,54.91 79.74,54.72 C11.1 79.74,52.17 C12.1 79.72,50.84 81.22,49.34 | U2.24 90.2,51.31 90.14,51.26 v90.14,51.21 | v81.25,49.38 81.22,49.34 | v86.08,66.88 86.36,66.6 L2.1 | C9.1 77.73,56.3 75.49,58.55 75.49,65.91 v75.89,66.32 81.6,66.32 C23.2 | 84.89,24.81 87.38,24.81 IC1.1 88.49,26.9 88.57,26.97 90.14,26.97 90.4,26.72 90.4,25.95 IC1.3 | v79.27,26.34 79.45,26.52 80.11,26.52 80.37,26.77 D1.C 82.5,25.11 81.89,24.5 | 79.91,43.21 81.23,44.53 81.23,49.17 81.23,49.33 81.22,49.34
  Top 0.305: 81.05,49.35 81.23,49.17 | Q5.3 71.78,45.06 73.74,47.02 76.73,47.02 78.82,44.93 F1.2 | C31.1 27.3,3.01 28.42,1.89 74.61,1.89 77.19,4.47 77.19,8.1 v77.67,8.58
  Top 0.406: C2.1 81.89,24.5
  Bottom 0.254: v78.23,54.53 78.23,30.99 79.63,29.59 79.63,27.58 79.27,27.23 v79.27,26.34 | v90.14,51.21 90.14,50.88 88.59,49.33 81.3,49.33 v81.25,49.38 | v86.08,66.88 85.72,66.52 84.78,66.52 80.01,66.52 79.81,66.32 v75.89,66.32
  Bottom 0.305: v79.27,26.34 79.27,24.86 77.8,23.39 77.8,8.71 v77.67,8.58
VNEG-IN  (via drill 0.35, 0.4)
  Top 0.203: 92.49,55.2 92.6,55.09 D4.A
  Top 0.254: U2.16 86.2,54.45 v85.79,54.04 85.71,53.96 C13.2 85.71,49.61 C16.2 | U2.26 U2.27 | U2.22 89.2,55.14 v89.18,55.12 | U2.26 | U2.26 91.8,57.36 v92.2,56.96 92.2,55.49 92.49,55.2
  Bottom 0.25: v89.18,55.12 88.1,54.04 v85.79,54.04
  Bottom 0.254: v89.18,55.12 89.26,55.04 91.62,55.04 92.3,55.73 92.3,56.86 v92.2,56.96
XCL  (via drill 0.35)
  Top 0.229: v43.05,63.4 45.35,61.1 U$1.109
  Top 0.254: J1.8 23.22,63.75 v34.11,63.75
  Bottom 0.229: v34.11,63.75 34.29,63.58 42.88,63.58 v43.05,63.4
XLE  (via drill 0.35)
  Top 0.229: J1.10 24.6,62.78 v24.74,62.92 | v44.31,52.04 44.55,51.8 U$1.107
  Bottom 0.229: v24.74,62.92 24.74,51.87 25.86,50.75 43.02,50.75 v44.31,52.04
XOE
  Top 0.229: J1.11 31.49,62.28 31.5,62.28 32.39,62.28 33.63,61.04 33.63,59.59 33.98,59.23 36.96,59.23 37.26,59.54 U$1.77
XSTL  (via drill 0.35)
  Top 0.229: U$1.108 44.95,60.18 v42.37,62.76 | v31.8,61.52 31.55,61.77 27.33,61.77
  Top 0.254: 27.33,61.77 J1.12
  Bottom 0.229: v31.8,61.52 34.39,61.52 35.64,62.76 v42.37,62.76

## Text on the board
tPlace: UART | RX-TX
tNames: charge module / output 5v | - +